# Altium schematic sheet Cheater Dice.SchDoc
size A4
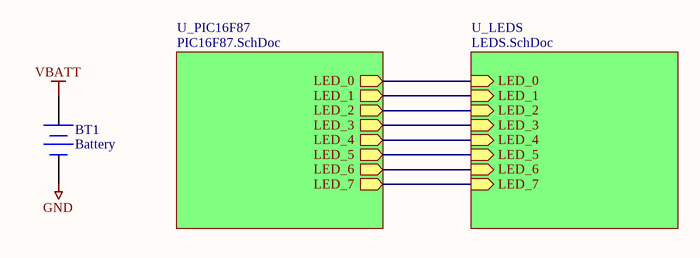
[diagram p0: Cheater Dice.SchDoc]

## Parts
BT1  Battery  [CR2032]

## Sub-sheets
U_LEDS = LEDS.SchDoc: LED_0 (in), LED_1 (in), LED_2 (in), LED_3 (in), LED_4 (in), LED_5 (in), LED_6 (in), LED_7 (in)
U_PIC16F87 = PIC16F87.SchDoc: LED_0 (out), LED_1 (out), LED_2 (out), LED_3 (out), LED_4 (out), LED_5 (out), LED_6 (out), LED_7 (out)

## Nets
GND: BT1.2(-)
VBATT: BT1.1(+)
(unnamed): sheet U_LEDS/LED_0, sheet U_PIC16F87/LED_0
(unnamed): sheet U_LEDS/LED_1, sheet U_PIC16F87/LED_1
(unnamed): sheet U_LEDS/LED_2, sheet U_PIC16F87/LED_2
(unnamed): sheet U_LEDS/LED_3, sheet U_PIC16F87/LED_3
(unnamed): sheet U_LEDS/LED_4, sheet U_PIC16F87/LED_4
(unnamed): sheet U_LEDS/LED_5, sheet U_PIC16F87/LED_5
(unnamed): sheet U_LEDS/LED_6, sheet U_PIC16F87/LED_6
(unnamed): sheet U_LEDS/LED_7, sheet U_PIC16F87/LED_7

## Library data of the parts
BT1 = Battery: Multicell Battery; Published: 24-Mar-1999; LatestRevisionDate: 17-Jul-2002; LatestRevisionNote: Re-released for DXP Platform.; PackageReference: BAT-2; Publisher: Altium Limited; PackageDescription: Battery; 2 Leads